# EAGLE design referencia (EAGLE 9.6.2)
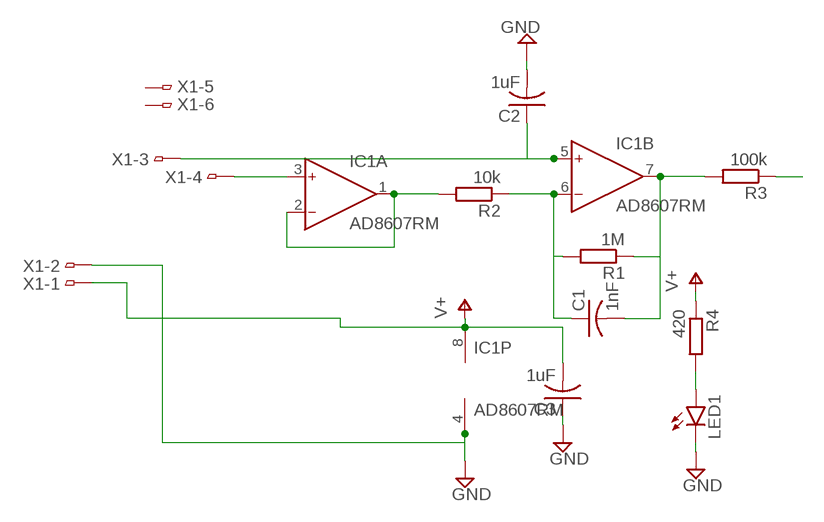
[diagram p0: schematic, sheet 1]

## Parts
C1  1nF  C-USC0603  [C0603]
C2  1uF  C-USC0603  [C0603]
C3  1uF  C-USC0603  [C0603]
IC1  AD8607RM  [MSOP08]
LED1  LEDSML0805  [SML0805]
R1  1M  R-EU_R0603  [R0603]
R2  10k  R-EU_R0603  [R0603]
R3  100k  R-EU_R0603  [R0603]
R4  420  R-EU_R0603  [R0603]
X1  FH12-08S-1SH  [FH12-08S-1SH]

## Nets
GND: C2.2 C3.1 IC1.4(P:V-) LED1.C X1.2
N$1: IC1.1(A:OUT) IC1.2(A:IN-) R2.2
N$2: C1.1 IC1.6(B:IN-) R1.2 R2.1
N$3: C1.2 IC1.7(B:OUT) R1.1 R3.2
N$4: IC1.3(A:IN+) X1.4
N$5: C2.1 IC1.5(B:IN+) X1.3
N$6: LED1.A R4.2
REF: R3.1
V+: C3.2 IC1.8(P:V+) R4.1 X1.1
Unconnected: X1.5 X1.6

## Library data of the parts
C1-C3 = rcl:C-US: CAPACITOR, American symbol; SPICEPREFIX: C
IC1 = analog-devices:AD8607: Precision Micropower, Low Noise CMOS, Rail-to-Rail Input/Output Operational Amplifiers Source: http://www.analog.com/static/imported-files/data_sheets/AD8603_8607_8609.pdf; MF: ALTERA CORPORATION; MPN: AD8607ARMZ-REEL; OC_FARNELL: 1464990; OC_NEWARK: 59K6925
LED1 = led:LED: LED OSRAM: - CHIPLED LG R971, LG N971, LY N971, LG Q971, LY Q971, LO R971, LY R971 LH N974, LH R974 LS Q976, LO Q976, LY Q976 LO Q996 - Hyper CHIPLED LW Q18S LB Q993, LB Q99A, LB R99A - SideLED LS A670, LO A670, LY A670, LG A670, LP A670 LB A673, LV A673, LT A673, LW A673 LH A674 LY A675 LS A676, LA A676, LO A676, LY A676, LW A676 LS A679, LY A679, LG A679 - Hyper Micro SIDELED® LS Y876, LA Y876, LO Y876, LY Y876 LT Y87S - SmartLED LW L88C, LW L88S LB L89C, LB L89S, LG L890 LS L89K, LO L89K, LY L89K LS L896, LA L896, LO L896, LY L896 - TOPLED LS T670, LO T670, LY T670, LG T670, LP T670 LSG T670, LSP T670, LSY T670, LOP T670, LYG T670 LG T671, LOG T671, LSG T671 LB T673, LV T673, LT T673, LW T673 LH T674 LS T676, LA T676, LO T676, LY T676, LB T676, LH T676, LSB T676, LW T676 LB T67C, LV T67C, LT T67C, LS T67K, LO T67K, LY T67K, LW E67C LS E67B, LA E67B, LO E67B, LY E67B, LB E67C, LV E67C, LT E67C LW T67C LS T679, LY T679, LG T679 LS T770, LO T770, LY T770, LG T770, LP T770 LB T773, LV T773, LT T773, LW T773 LH T774 LS E675, LA E675, LY E675, LS T675 LS T776, LA T776, LO T776, LY T776, LB T776 LHGB T686 LT T68C, LB T68C - Hyper Mini TOPLED® LB M676 - Mini TOPLED Santana® LG M470 LS M47K, LO M47K, LY M47K Source: http://www.osram.convergy.de LUXEON: - LUMILED® LXK2-PW12-R00, LXK2-PW12-S00, LXK2-PW14-U00, LXK2-PW14-V00 LXK2-PM12-R00, LXK2-PM12-S00, LXK2-PM14-U00 LXK2-PE12-Q00, LXK2-PE12-R00, LXK2-PE12-S00, LXK2-PE14-T00, LXK2-PE14-U00 LXK2-PB12-K00, LXK2-PB12-L00, LXK2-PB12-M00, LXK2-PB14-N00, LXK2-PB14-P00, LXK2-PB14-Q00 LXK2-PR12-L00, LXK2-PR12-M00, LXK2-PR14-Q00, LXK2-PR14-R00 LXK2-PD12-Q00, LXK2-PD12-R00, LXK2-PD12-S00 LXK2-PH12-R00, LXK2-PH12-S00 LXK2-PL12-P00, LXK2-PL12-Q00, LXK2-PL12-R00 Source: www.luxeon.com KINGBRIGHT: KA-3528ASYC Source: www.kingbright.com
R1-R4 = rcl:R-EU_: RESISTOR, European symbol; SPICEPREFIX: R
X1 = JST-PH-6-1mm:FH12-08S-1S: 1mm Pitch Connectors For FPC/FFC Source: Data sheet <http://www.hirose.co.jp/cataloge_hp/e58605370.pdf>; OC_FARNELL: unknown; OC_NEWARK: unknown

## Board
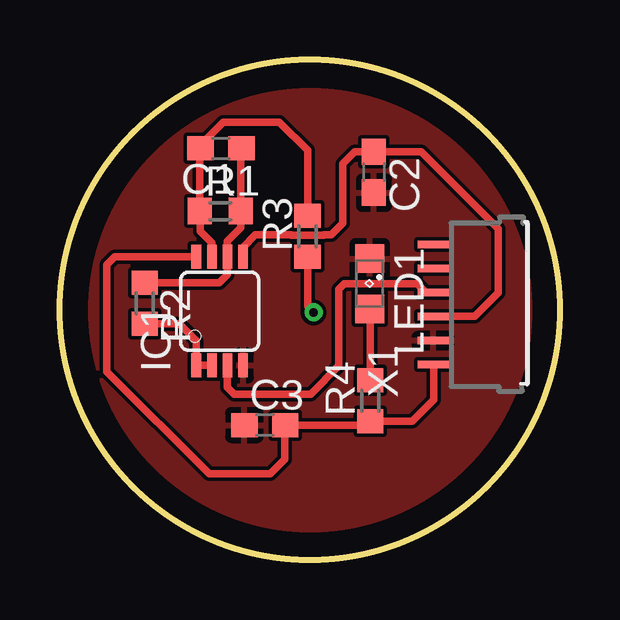
[diagram p1: board, top side]
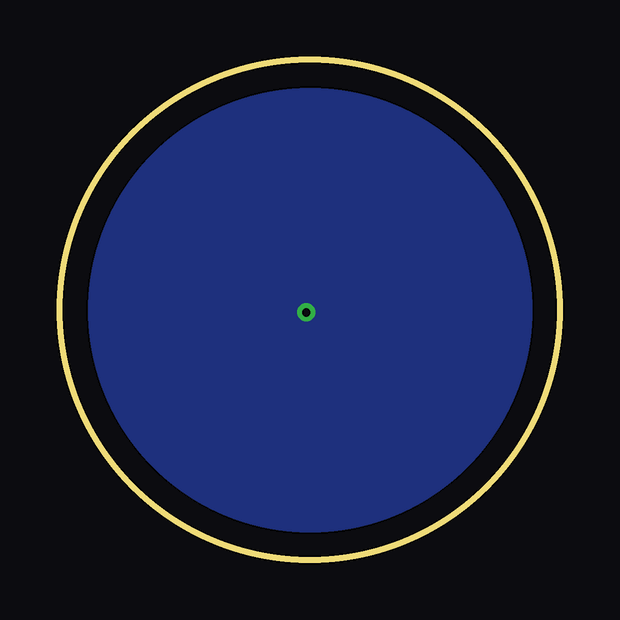
[diagram p2: board, bottom side, seen from below]

Size 20.83 x 20.83 mm. Coordinates in mm from the lower left corner, seen from the top.
Outline: circle at 10.41,10.41 radius 10.41
Copper layers (1*16): Top 0.035mm / dielectric 1.5mm / Bottom 0.035mm
Design rules "default": minimum track width 6mil, minimum drill 0.35mm, track to track 6mil, track to pad 6mil, pad to pad 6mil, via to via 6mil, smd to smd 6mil, copper to edge 40mil, drill to drill 6mil, minimum pad ring 10mil, minimum via ring 8mil, stop-mask expansion 4mil, vias tented up to drill 0mil, thermal gap 10mil

### Footprints (pad centres in the part's own frame; a part is rotated, then mirrored left to right if it is on the bottom)
C0603 = smd 1.1 x 1: 1 -0.85,0; 2 0.85,0
MSOP08 = smd 0.4 x 1: 1 -0.976,-2.263; 2 -0.326,-2.263; 3 0.324,-2.263; 4 0.974,-2.263; 5 0.974,2.262; 6 0.324,2.262; 7 -0.326,2.262; 8 -0.976,2.262
SML0805 = smd 1.2 x 1.2: A 1.05,0; C -1.05,0
R0603 = smd 1 x 1.1: 1 -0.85,0; 2 0.85,0
FH12-08S-1SH = smd 0.3 x 1.3: 1 -2.5,3.25; 2 -1.5,3.25; 3 -0.5,3.25; 4 0.5,3.25; 5 1.5,3.25; 6 2.5,3.25

### Placement (x,y rotation side)
C1  6.71,17.14 180 top
C2  13.08,16.15 270 top
C3  8.53,5.61 0 top
IC1  6.65,10.36 0 top
LED1  12.9,11.51 270 top
R1  6.68,14.53 0 top
R2  3.53,10.69 270 top
R3  10.31,13.49 90 top
R4  12.93,6.63 90 top
X1  18.8,10.64 90 top

### Tracks (layer width: path | path; a pad name or v marks a point on that pad's centre or on a via)
GND
  pour Top: 2.4,16.87 1.9,16.21 arc43 0.05,9.65 arc44 3.87,2.35 arc41 10.42,-0.01 arc83 20.79,9.42 arc148
N$1
  Top 0.305: IC1.2 IC1.1 5.68,9.13 4.97,9.84 R2.2
N$2
  Top 0.305: R2.1 6.64,11.54 6.98,11.88 IC1.6 6.98,13.28 7.53,13.83 R1.2 7.53,17.12 C1.1
N$3
  Top 0.305: IC1.7 6.33,13.2 5.84,13.69 5.84,14.52 R1.1 5.83,17.12 C1.2 5.86,17.29 6.81,18.24 9.14,18.24 10.31,17.07 R3.2
N$4
  Top 0.305: IC1.3 6.98,7.19 7.26,6.91 10.44,6.91 11.62,8.09 11.62,11.28 11.85,11.51 14.88,11.51 15.25,11.14 X1.4
N$5
  Top 0.305: IC1.5 7.63,13.03 8.14,13.54 9.63,13.54 9.64,13.53 10.99,13.53 10.99,13.54 11.3,13.54 11.79,14.02 11.79,16.51 12.28,17 C2.1 15.05,17 18.26,13.79 18.26,11.12 17.28,10.14 X1.3
N$6
  Top 0.305: R4.2 12.93,10.43 LED1.A
REF  (via drill 0.35)
  Top 0.305: v10.57,10.31 10.31,10.57 R3.1
  pour Bottom: 7.22,20.36 6.62,20.15 arc42 1.42,15.72 arc64 2.02,4.31 arc71 13.12,0.37 arc58 20.31,7.59 arc123
V+
  Top 0.305: IC1.8 2.29,12.62 1.96,12.29 1.96,7.85 6.22,3.58 8.76,3.58 9.37,4.19 C3.2 12.76,5.61 R4.1 14.67,5.78 15.57,6.68 15.57,8.12 X1.1